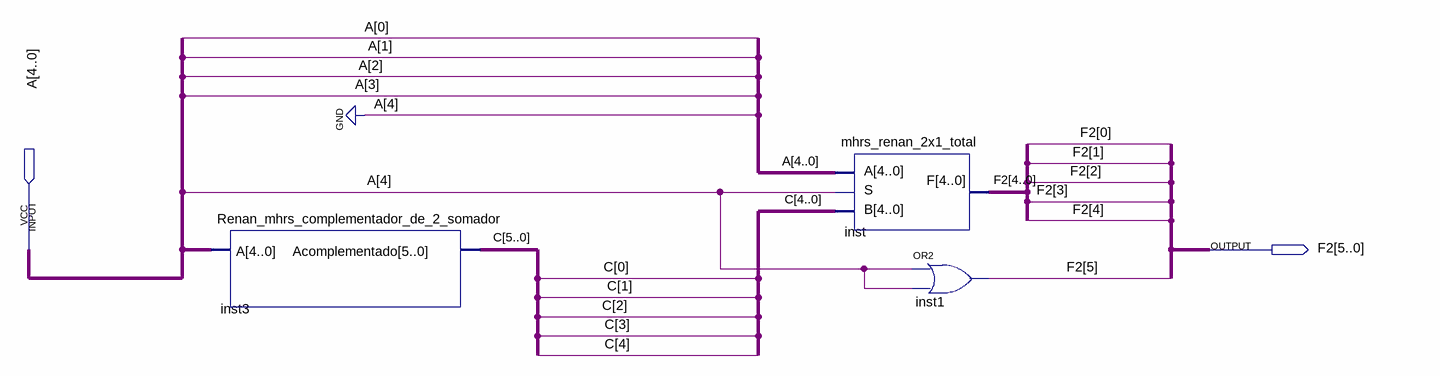
[diagram p0: schematic sheet]
// Quartus schematic mhrs_Selecionador_de_cmp2.bdf as structural Verilog: 3 symbols, 2 pins
module mhrs_Selecionador_de_cmp2 (
  input  [4:0] A,
  output [5:0] F2
);

  wire [5:0] C;

  Renan_mhrs_complementador_de_2_somador inst3 (.A(A), .Acomplementado(C));
  mhrs_renan_2x1_total inst (.S(A[4]), .A(A), .B(C[4:0]), .F(F2[4:0]));
  or inst1 (F2[5], A[4], A[4]);
  // also tied to GND on the sheet: A[4]
endmodule
